# EAGLE design Mosfets (EAGLE 9.3.2)
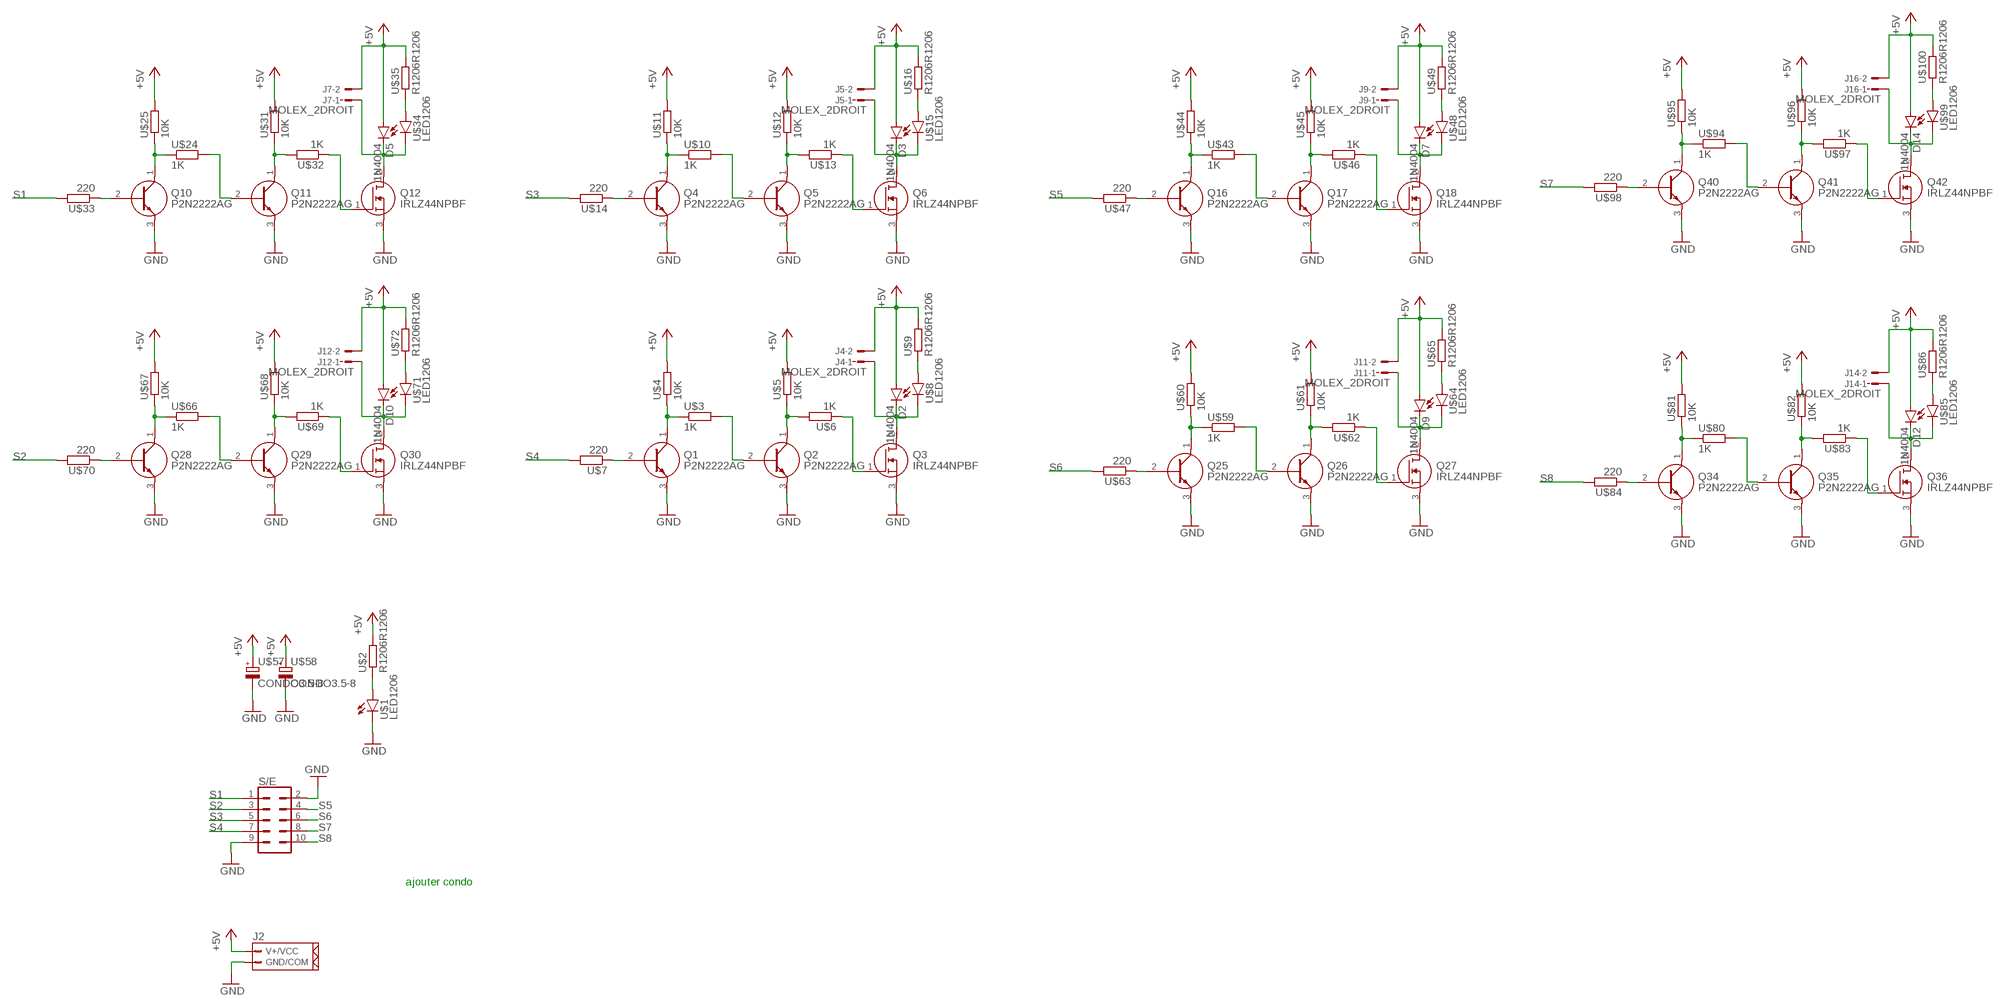
[diagram p0: schematic, sheet 1]

## Parts
D2  1N4004  [DO41-10]
D3  1N4004  [DO41-10]
D5  1N4004  [DO41-10]
D7  1N4004  [DO41-10]
D9  1N4004  [DO41-10]
D10  1N4004  [DO41-10]
D12  1N4004  [DO41-10]
D14  1N4004  [DO41-10]
J2  MOLEX_2_PUISS90°  [CON_2_PUISS_90°]
J4  MOLEX_2DROIT  [CON_2_DROIT]
J5  MOLEX_2DROIT  [CON_2_DROIT]
J7  MOLEX_2DROIT  [CON_2_DROIT]
J9  MOLEX_2DROIT  [CON_2_DROIT]
J11  MOLEX_2DROIT  [CON_2_DROIT]
J12  MOLEX_2DROIT  [CON_2_DROIT]
J14  MOLEX_2DROIT  [CON_2_DROIT]
J16  MOLEX_2DROIT  [CON_2_DROIT]
Q1  P2N2222AG  [TO-92]
Q2  P2N2222AG  [TO-92]
Q3  IRLZ44NPBF  [TO254P469X1042X1967-3P]
Q4  P2N2222AG  [TO-92]
Q5  P2N2222AG  [TO-92]
Q6  IRLZ44NPBF  [TO254P469X1042X1967-3P]
Q10  P2N2222AG  [TO-92]
Q11  P2N2222AG  [TO-92]
Q12  IRLZ44NPBF  [TO254P469X1042X1967-3P]
Q16  P2N2222AG  [TO-92]
Q17  P2N2222AG  [TO-92]
Q18  IRLZ44NPBF  [TO254P469X1042X1967-3P]
Q25  P2N2222AG  [TO-92]
Q26  P2N2222AG  [TO-92]
Q27  IRLZ44NPBF  [TO254P469X1042X1967-3P]
Q28  P2N2222AG  [TO-92]
Q29  P2N2222AG  [TO-92]
Q30  IRLZ44NPBF  [TO254P469X1042X1967-3P]
Q34  P2N2222AG  [TO-92]
Q35  P2N2222AG  [TO-92]
Q36  IRLZ44NPBF  [TO254P469X1042X1967-3P]
Q40  P2N2222AG  [TO-92]
Q41  P2N2222AG  [TO-92]
Q42  IRLZ44NPBF  [TO254P469X1042X1967-3P]
S/E  CON_5X2SHD  [2X5-SHROUDED]
U$1  LED1206  [1206]
U$2  R1206R1206  [R1206]
U$3  1K  R1206R1206  [R1206]
U$4  10K  R1206R1206  [R1206]
U$5  10K  R1206R1206  [R1206]
U$6  1K  R1206R1206  [R1206]
U$7  220  R1206R1206  [R1206]
U$8  LED1206  [1206]
U$9  R1206R1206  [R1206]
U$10  1K  R1206R1206  [R1206]
U$11  10K  R1206R1206  [R1206]
U$12  10K  R1206R1206  [R1206]
U$13  1K  R1206R1206  [R1206]
U$14  220  R1206R1206  [R1206]
U$15  LED1206  [1206]
U$16  R1206R1206  [R1206]
U$24  1K  R1206R1206  [R1206]
U$25  10K  R1206R1206  [R1206]
U$31  10K  R1206R1206  [R1206]
U$32  1K  R1206R1206  [R1206]
U$33  220  R1206R1206  [R1206]
U$34  LED1206  [1206]
U$35  R1206R1206  [R1206]
U$43  1K  R1206R1206  [R1206]
U$44  10K  R1206R1206  [R1206]
U$45  10K  R1206R1206  [R1206]
U$46  1K  R1206R1206  [R1206]
U$47  220  R1206R1206  [R1206]
U$48  LED1206  [1206]
U$49  R1206R1206  [R1206]
U$57  CONDO3.5-8  [E3,5-8]
U$58  CONDO3.5-8  [E3,5-8]
U$59  1K  R1206R1206  [R1206]
U$60  10K  R1206R1206  [R1206]
U$61  10K  R1206R1206  [R1206]
U$62  1K  R1206R1206  [R1206]
U$63  220  R1206R1206  [R1206]
U$64  LED1206  [1206]
U$65  R1206R1206  [R1206]
U$66  1K  R1206R1206  [R1206]
U$67  10K  R1206R1206  [R1206]
U$68  10K  R1206R1206  [R1206]
U$69  1K  R1206R1206  [R1206]
U$70  220  R1206R1206  [R1206]
U$71  LED1206  [1206]
U$72  R1206R1206  [R1206]
U$80  1K  R1206R1206  [R1206]
U$81  10K  R1206R1206  [R1206]
U$82  10K  R1206R1206  [R1206]
U$83  1K  R1206R1206  [R1206]
U$84  220  R1206R1206  [R1206]
U$85  LED1206  [1206]
U$86  R1206R1206  [R1206]
U$94  1K  R1206R1206  [R1206]
U$95  10K  R1206R1206  [R1206]
U$96  10K  R1206R1206  [R1206]
U$97  1K  R1206R1206  [R1206]
U$98  220  R1206R1206  [R1206]
U$99  LED1206  [1206]
U$100  R1206R1206  [R1206]

## Nets
+5V: D2.A D3.A D5.A D7.A D9.A D10.A D12.A D14.A J2.P$2(V+/VCC) J4.2 J5.2 J7.2 J9.2 J11.2 J12.2 J14.2 J16.2 U$2.2 U$4.2 U$5.2 U$9.2 U$11.2 U$12.2 U$16.2 U$25.2 U$31.2 U$35.2 U$44.2 U$45.2 U$49.2 U$57.+ U$58.+ U$60.2 U$61.2 U$65.2 U$67.2 U$68.2 U$72.2 U$81.2 U$82.2 U$86.2 U$95.2 U$96.2 U$100.2
GND: J2.P$1(GND/COM) Q1.3(E) Q2.3(E) Q3.3(S) Q4.3(E) Q5.3(E) Q6.3(S) Q10.3(E) Q11.3(E) Q12.3(S) Q16.3(E) Q17.3(E) Q18.3(S) Q25.3(E) Q26.3(E) Q27.3(S) Q28.3(E) Q29.3(E) Q30.3(S) Q34.3(E) Q35.3(E) Q36.3(S) Q40.3(E) Q41.3(E) Q42.3(S) S/E.2 S/E.9 U$1.C U$57.- U$58.-
N$2: Q1.1(C) U$3.1 U$4.1
N$3: Q2.1(C) U$5.1 U$6.2
N$4: Q1.2(B) U$7.1
N$5: Q2.2(B) U$3.2
N$6: Q3.1(G) U$6.1
N$7: D2.C J4.1 Q3.2(D) U$8.C
N$8: U$8.A U$9.1
N$9: Q4.1(C) U$10.1 U$11.1
N$10: Q5.1(C) U$12.1 U$13.2
N$11: Q4.2(B) U$14.1
N$12: Q5.2(B) U$10.2
N$13: Q6.1(G) U$13.1
N$14: D3.C J5.1 Q6.2(D) U$15.C
N$15: Q28.1(C) U$66.1 U$67.1
N$16: U$15.A U$16.1
N$17: U$1.A U$2.1
N$25: Q10.1(C) U$24.1 U$25.1
N$26: Q11.1(C) U$31.1 U$32.2
N$27: Q10.2(B) U$33.1
N$28: Q11.2(B) U$24.2
N$29: Q12.1(G) U$32.1
N$30: D5.C J7.1 Q12.2(D) U$34.C
N$31: U$34.A U$35.1
N$39: Q16.1(C) U$43.1 U$44.1
N$40: Q17.1(C) U$45.1 U$46.2
N$41: Q16.2(B) U$47.1
N$42: Q17.2(B) U$43.2
N$43: Q18.1(G) U$46.1
N$44: D7.C J9.1 Q18.2(D) U$48.C
N$45: U$48.A U$49.1
N$54: Q29.1(C) U$68.1 U$69.2
N$58: Q25.1(C) U$59.1 U$60.1
N$60: Q26.1(C) U$61.1 U$62.2
N$61: Q25.2(B) U$63.1
N$62: Q26.2(B) U$59.2
N$63: Q27.1(G) U$62.1
N$64: D9.C J11.1 Q27.2(D) U$64.C
N$65: U$64.A U$65.1
N$66: Q28.2(B) U$70.1
N$67: Q29.2(B) U$66.2
N$68: Q30.1(G) U$69.1
N$69: D10.C J12.1 Q30.2(D) U$71.C
N$70: U$71.A U$72.1
N$78: Q34.1(C) U$80.1 U$81.1
N$79: Q35.1(C) U$82.1 U$83.2
N$80: Q34.2(B) U$84.1
N$81: Q35.2(B) U$80.2
N$82: Q36.1(G) U$83.1
N$83: D12.C J14.1 Q36.2(D) U$85.C
N$84: U$85.A U$86.1
N$92: Q40.1(C) U$94.1 U$95.1
N$93: Q41.1(C) U$96.1 U$97.2
N$94: Q40.2(B) U$98.1
N$95: Q41.2(B) U$94.2
N$96: Q42.1(G) U$97.1
N$97: D14.C J16.1 Q42.2(D) U$99.C
N$98: U$99.A U$100.1
S1: S/E.1 U$33.2
S2: S/E.3 U$70.2
S3: S/E.5 U$14.2
S4: S/E.7 U$7.2
S5: S/E.4 U$47.2
S6: S/E.6 U$63.2
S7: S/E.8 U$98.2
S8: S/E.10 U$84.2

## Notes on the sheet
- ajouter condo

## Library data of the parts
D2 D3 D5 D7 D9 D10 D12 D14 = AREA:1N4004: DIODE general purpose rectifier, 1 A
J2 = AREA:MOLEX_2_PUISS: Solid Header 3.96mm KK ,r/a,F/Lock,2w Molex KK Series, Series Number 41792, 3.96mm Pitch 2 Way 1 Row Right Angle PCB Header, Solder Termination, 7A Source: Datasheet <http://www.molex.com/webdocs/datasheets/pdf/en-us/0026605020_PCB_HEADERS.pdf>
J4 J5 J7 J9 J11 J12 J14 J16 = AREA:MOLEX_2: CONNECTOR wire to board 2.54 mm (.1 inch) pitch header; MF: MOLEX; OC_FARNELL: unknown; OC_NEWARK: unknown
Q1 Q2 Q4 Q5 Q10 Q11 Q16 Q17 Q25 Q26 Q28 Q29 Q34 Q35 Q40 Q41 = AREA:P2N2222AG: NPN transistor,P2N2222A 0.6A Ic 10Vce ON Semi P2N2222AG NPN Bipolar Transistor, 0.6 A 40 V, 3-Pin TO-92 Source: Datasheet <http://www.onsemi.com/pub/Collateral/P2N2222A-D.PDF>; ALLIED_NUMBER: R1107250; ALLIED_PRICE-STOCK: http://www.alliedelec.com/on-semiconductor-p2n2222ag/R1107250/; DESCRIPTION: NPN transistor,P2N2222A 0.6A Ic 10Vce ON Semi P2N2222AG NPN Bipolar Transistor, 0.6 A 40 V, 3-Pin TO-92; HEIGHT: mm; MANUFACTURER_NAME: ON Semiconductor; MANUFACTURER_PART_NUMBER: P2N2222AG; MOUSER_PART_NUMBER: 863-P2N2222AG; MOUSER_PRICE-STOCK: https://www.mouser.com/Search/Refine.aspx?Keyword=863-P2N2222AG; RS_PART_NUMBER: 5449624P; RS_PRICE-STOCK: http://uk.rs-online.com/web/p/products/5449624P
Q3 Q6 Q12 Q18 Q27 Q30 Q36 Q42 = AREA:IRLZ44NPBF: N-channel MOSFET,IRLZ44N 47A 55V Source: Datasheet <http://www.irf.com/product-info/datasheets/data/irlz44n.pdf>; DESCRIPTION: N-channel MOSFET,IRLZ44N 47A 55V; HEIGHT: 4.69mm; MANUFACTURER_NAME: International Rectifier; MANUFACTURER_PART_NUMBER: IRLZ44NPBF; RS_PART_NUMBER: 2509061408; RS_PRICE-STOCK: http://uk.rs-online.com/web/p/products/2509061408
S/E = AREA:CON_5X2: Multi connection point. Often used as Generic Header-pin footprint for 0.1 inch spaced/style header connections For AVR SPI programming port, see special device with nice symbol: "AVR_SPI_PROG_5x2.dev" You can populate with any combo of single row headers, but if you'd like an exact match, check these: 2x5 AVR ICSP Male Header <https://www.sparkfun.com/products/778> (PRT-00778) 2x5 Pin Shrouded Header <https://www.sparkfun.com/products/8506> (PRT-08506) On any of the 0.1 inch spaced packages, you can populate with these: Break Away Headers - Straight <https://www.sparkfun.com/products/116> (PRT-00116) Break Away Male Headers - Right Angle <https://www.sparkfun.com/products/553> (PRT-00553) Female Headers <https://www.sparkfun.com/products/115> (PRT-00115) Break Away Headers - Machine Pin <https://www.sparkfun.com/products/117> (PRT-00117) Break Away Female Headers - Swiss Machine Pin <https://www.sparkfun.com/products/743> (PRT-00743) Special note: the shrouded connector mates well with our 5x2 ribbon cables: 2x5 Pin IDC Ribbon Cable <https://www.sparkfun.com/products/8535> (PRT-08535); PROD_ID: CONN-08671; SF_ID: PRT-08506
U$1 U$8 U$15 U$34 U$48 U$64 U$71 U$85 U$99 = AREA:LED1206
U$2-U$7 U$9-U$14 U$16 U$24 U$25 U$31-U$33 U$35 U$43-U$47 U$49 U$59-U$63 U$65-U$70 U$72 U$80-U$84 U$86 U$94-U$98 U$100 = AREA:R1206
U$57 U$58 = AREA:CONDO

## Board
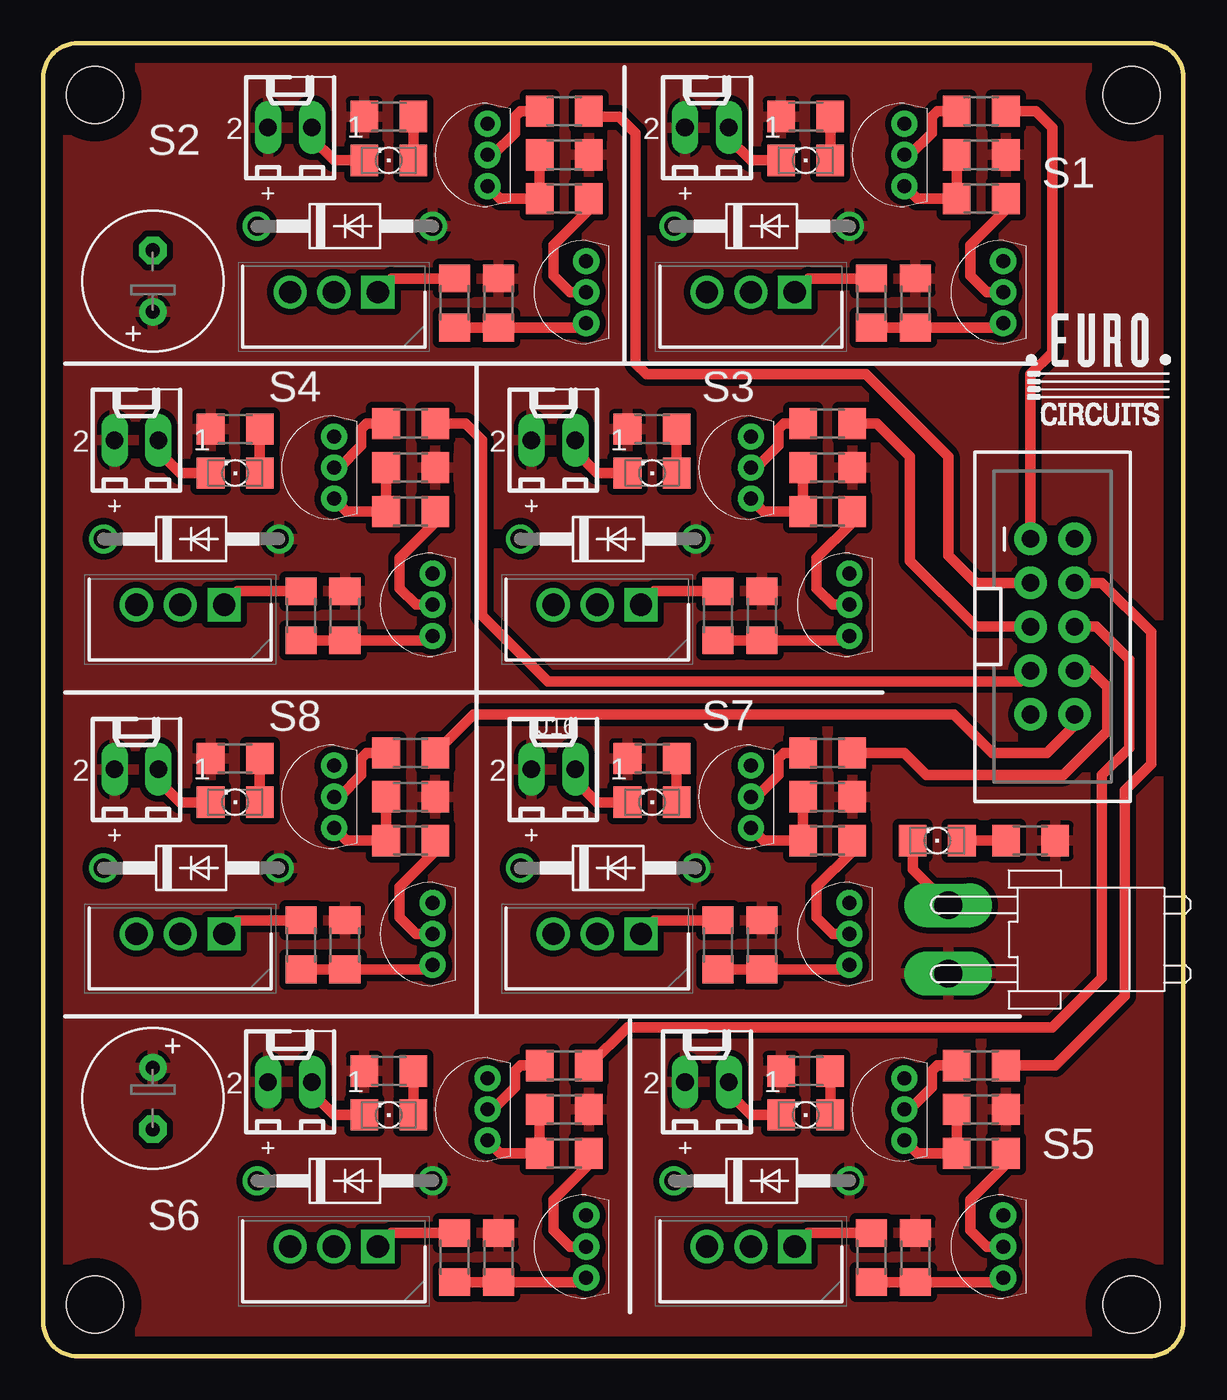
[diagram p1: board, top side]
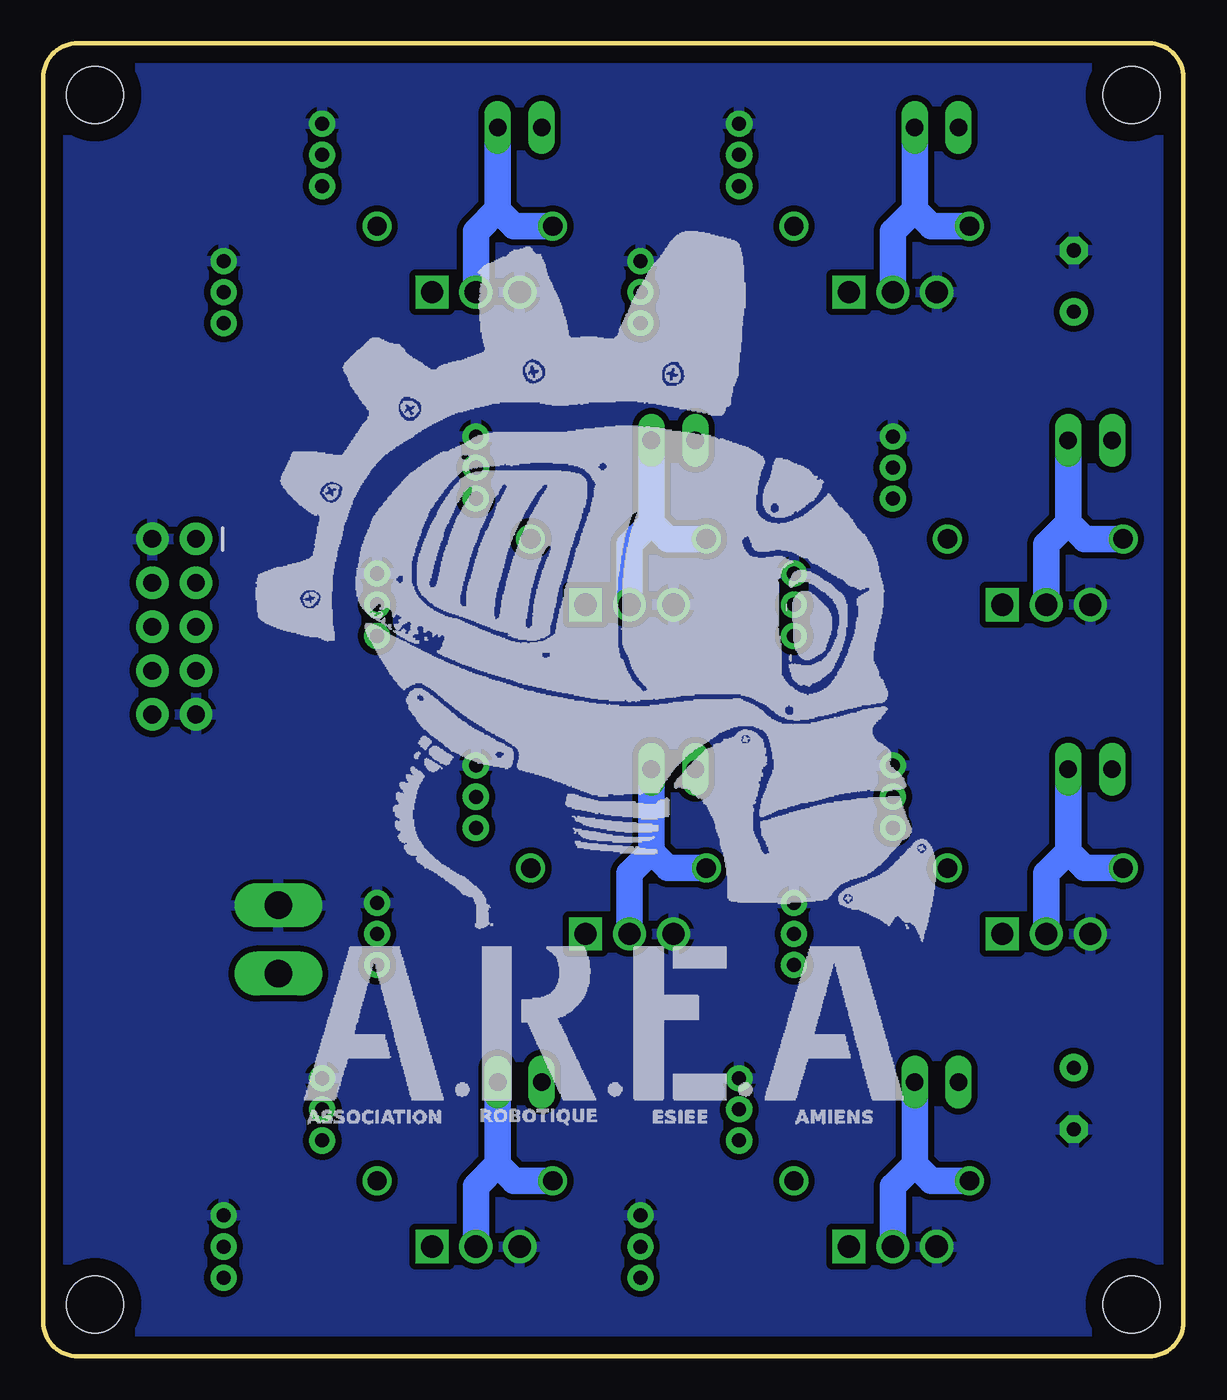
[diagram p2: board, bottom side, seen from below]

Size 66 x 76 mm. Coordinates in mm from the lower left corner, seen from the top.
Outline: 2,76 arc90 0,74 0,2 arc90 2,0 64,0 arc90 66,2 66,74 arc90 64,76 2,76
Copper layers (1*16): Top 0.035mm / dielectric 1.5mm / Bottom 0.035mm
Design rules "default *": minimum track width 12mil, minimum drill 0.35mm, track to track 14mil, track to pad 12mil, pad to pad 10mil, via to via 12mil, smd to smd 12mil, copper to edge 40mil, drill to drill 6mil, minimum pad ring 10mil, minimum via ring 8mil, stop-mask expansion 4mil, vias tented up to drill 0mil, thermal gap 10mil
Holes 3.3 mm at 63,3 3,3 3,73 63,73

### Footprints (pad centres in the part's own frame; a part is rotated, then mirrored left to right if it is on the bottom)
DO41-10 = drill 1.118: A 5.08,0; C -5.08,0
CON_2_PUISS_90° = drill 1.6 pad 2.54 long: P$1 -1.98,0; P$2 1.98,0
CON_2_DROIT = drill 1.016 long: 1 1.27,0; 2 -1.27,0
TO-92 = drill 0.81 pad 1.51: 1 0,-1.8; 2 0,0; 3 0,1.8
TO254P469X1042X1967-3P = drill 1.28 pad 1.92 square: 1 0,0 | drill 1.28 pad 1.92: 2 2.54,0; 3 5.08,0
2X5-SHROUDED = drill 1.016 pad 1.88: 1 -1.27,5.08; 2 1.27,5.08; 3 -1.27,2.54; 4 1.27,2.54; 5 -1.27,0; 6 1.27,0; 7 -1.27,-2.54; 8 1.27,-2.54; 9 -1.27,-5.08; 10 1.27,-5.08
1206 = smd 1.6 x 1.803: A -1.422,0; C 1.422,0
R1206 = smd 1.6 x 1.803: 1 -1.422,0; 2 1.422,0
E3,5-8 = drill 0.813 pad 1.6: + -1.778,0 | drill 0.813 pad 1.6 octagon: - 1.778,0

### Placement (x,y rotation side)
D2  8.57,47.31 0 top
D3  32.7,47.31 0 top
D5  41.59,65.41 0 top
D7  41.59,10.16 0 top
D9  17.46,10.16 0 top
D10  17.46,65.41 0 top
D12  8.57,28.26 0 top
D14  32.7,28.26 0 top
J2  52.39,24.13 270 top
J4  5.4,53.02 0 top
J5  29.53,53.02 0 top
J7  38.42,71.12 0 top
J9  38.42,15.88 0 top
J11  14.29,15.88 0 top
J12  14.29,71.12 0 top
J14  5.4,33.97 0 top
J16  29.53,33.97 0 top
Q1  16.83,51.44 0 top
Q2  22.54,43.5 0 top
Q3  10.48,43.5 180 top
Q4  40.96,51.44 0 top
Q5  46.67,43.5 0 top
Q6  34.61,43.5 180 top
Q10  49.85,69.53 0 top
Q11  55.56,61.59 0 top
Q12  43.5,61.59 180 top
Q16  49.85,14.29 0 top
Q17  55.56,6.35 0 top
Q18  43.5,6.35 180 top
Q25  25.72,14.29 0 top
Q26  31.43,6.35 0 top
Q27  19.37,6.35 180 top
Q28  25.72,69.53 0 top
Q29  31.43,61.59 0 top
Q30  19.37,61.59 180 top
Q34  16.83,32.38 0 top
Q35  22.54,24.45 0 top
Q36  10.48,24.45 180 top
Q40  40.96,32.38 0 top
Q41  46.67,24.45 0 top
Q42  34.61,24.45 180 top
S/E  58.42,42.23 0 top
U$1  51.75,29.84 180 top
U$2  57.15,29.84 0 top
U$3  21.27,48.9 0 top
U$4  21.27,51.44 0 top
U$5  17.46,42.86 90 top
U$6  14.92,42.86 270 top
U$7  21.27,53.98 0 top
U$8  11.11,51.12 180 top
U$9  11.11,53.66 180 top
U$10  45.4,48.9 0 top
U$11  45.4,51.44 0 top
U$12  41.59,42.86 90 top
U$13  39.05,42.86 270 top
U$14  45.4,53.98 0 top
U$15  35.24,51.12 180 top
U$16  35.24,53.66 180 top
U$24  54.29,66.99 0 top
U$25  54.29,69.53 0 top
U$31  50.48,60.96 90 top
U$32  47.94,60.96 270 top
U$33  54.29,72.07 0 top
U$34  44.13,69.22 180 top
U$35  44.13,71.75 180 top
U$43  54.29,11.75 0 top
U$44  54.29,14.29 0 top
U$45  50.48,5.71 90 top
U$46  47.94,5.71 270 top
U$47  54.29,16.83 0 top
U$48  44.13,13.97 180 top
U$49  44.13,16.51 180 top
U$57  6.35,62.23 90 top
U$58  6.35,14.92 270 top
U$59  30.16,11.75 0 top
U$60  30.16,14.29 0 top
U$61  26.35,5.71 90 top
U$62  23.81,5.71 270 top
U$63  30.16,16.83 0 top
U$64  20,13.97 180 top
U$65  20,16.51 180 top
U$66  30.16,66.99 0 top
U$67  30.16,69.53 0 top
U$68  26.35,60.96 90 top
U$69  23.81,60.96 270 top
U$70  30.16,72.07 0 top
U$71  20,69.22 180 top
U$72  20,71.75 180 top
U$80  21.27,29.84 0 top
U$81  21.27,32.38 0 top
U$82  17.46,23.81 90 top
U$83  14.92,23.81 270 top
U$84  21.27,34.92 0 top
U$85  11.11,32.07 180 top
U$86  11.11,34.61 180 top
U$94  45.4,29.84 0 top
U$95  45.4,32.38 0 top
U$96  41.59,23.81 90 top
U$97  39.05,23.81 270 top
U$98  45.4,34.92 0 top
U$99  35.24,32.07 180 top
U$100  35.24,34.61 180 top

### Tracks (layer width: path | path; a pad name or v marks a point on that pad's centre or on a via)
+5V
  pour Top: -3.81,77.15 -3.81,-6.03 71.12,-6.03 71.12,77.15
GND
  Top 0.61: U$1.C 50.33,28.17 J2.P$1
  pour Bottom: -5.71,79.06 -5.71,-7.62 73.34,-7.62 73.34,79.06
N$2
  Top 0.61: U$4.1 U$3.1 17.57,48.9 Q1.1
N$3
  Top 0.61: U$6.2 U$5.1 22.29,41.44 Q2.1
N$4
  Top 0.61: U$7.1 18.73,53.98 18.41,53.66 18.41,52.7 17.14,51.44 Q1.2
N$5
  Top 0.61: U$3.2 22.7,48.26 20.64,46.2 20.64,44.45 21.59,43.5 Q2.2
N$6
  Top 0.61: U$6.1 11.26,44.28 Q3.1
N$7
  Top 0.61: U$8.C 7.94,51.12 6.67,52.39 J4.1
  Bottom 1.524: J4.1 6.67,48.26 | 6.67,48.26 7.94,46.99 Q3.2 | D2.C 5.71,47.31 6.67,48.26
N$8
  Top 0.61: U$9.1 U$8.A
N$9
  Top 0.61: U$11.1 U$10.1 41.7,48.9 Q4.1
N$10
  Top 0.61: U$13.2 U$12.1 46.42,41.44 Q5.1
N$11
  Top 0.61: U$14.1 42.86,53.98 42.55,53.66 42.55,52.7 41.27,51.44 Q4.2
N$12
  Top 0.61: U$10.2 46.83,48.26 44.77,46.2 44.77,44.45 45.72,43.5 Q5.2
N$13
  Top 0.61: U$13.1 35.4,44.28 Q6.1
N$14
  Top 0.61: U$15.C 32.07,51.12 30.8,52.39 J5.1
  Bottom 1.524: J5.1 30.8,48.26 | 30.8,48.26 32.07,46.99 Q6.2 | D3.C 29.84,47.31 30.8,48.26
N$15
  Top 0.61: U$67.1 U$66.1 26.46,66.99 Q28.1
N$16
  Top 0.61: U$16.1 U$15.A
N$17
  Top 0.61: U$2.1 U$1.A
N$25
  Top 0.61: U$25.1 U$24.1 50.59,66.99 Q10.1
N$26
  Top 0.61: U$32.2 U$31.1 55.31,59.54 Q11.1
N$27
  Top 0.61: U$33.1 51.75,72.07 51.44,71.75 51.44,70.8 50.16,69.53 Q10.2
N$28
  Top 0.61: U$24.2 55.72,66.36 53.66,64.3 53.66,62.55 54.61,61.59 Q11.2
N$29
  Top 0.61: U$32.1 44.28,62.38 Q12.1
N$30
  Top 0.61: U$34.C 40.96,69.22 39.69,70.48 J7.1
  Bottom 1.524: J7.1 39.69,66.36 | 39.69,66.36 40.96,65.09 Q12.2 | D5.C 38.73,65.41 39.69,66.36
N$31
  Top 0.61: U$35.1 U$34.A
N$39
  Top 0.61: U$44.1 U$43.1 50.59,11.75 Q16.1
N$40
  Top 0.61: U$46.2 U$45.1 55.31,4.29 Q17.1
N$41
  Top 0.61: U$47.1 51.75,16.83 51.44,16.51 51.44,15.56 50.16,14.29 Q16.2
N$42
  Top 0.61: U$43.2 55.72,11.11 53.66,9.06 53.66,7.3 54.61,6.35 Q17.2
N$43
  Top 0.61: U$46.1 44.28,7.14 Q18.1
N$44
  Top 0.61: U$48.C 40.96,13.97 39.69,15.24 J9.1
  Bottom 1.524: J9.1 39.69,11.11 | 39.69,11.11 40.96,9.84 Q18.2 | D7.C 38.73,10.16 39.69,11.11
N$45
  Top 0.61: U$49.1 U$48.A
N$54
  Top 0.61: U$69.2 U$68.1 31.18,59.54 Q29.1
N$58
  Top 0.61: U$60.1 U$59.1 26.46,11.75 Q25.1
N$60
  Top 0.61: U$62.2 U$61.1 31.18,4.29 Q26.1
N$61
  Top 0.61: U$63.1 27.62,16.83 27.3,16.51 27.3,15.56 26.04,14.29 Q25.2
N$62
  Top 0.61: U$59.2 31.58,11.11 29.53,9.06 29.53,7.3 30.48,6.35 Q26.2
N$63
  Top 0.61: U$62.1 20.15,7.14 Q27.1
N$64
  Top 0.61: U$64.C 16.83,13.97 15.56,15.24 J11.1
  Bottom 1.524: J11.1 15.56,11.11 | 15.56,11.11 16.83,9.84 Q27.2 | D9.C 14.61,10.16 15.56,11.11
N$65
  Top 0.61: U$65.1 U$64.A
N$66
  Top 0.61: U$70.1 27.62,72.07 27.3,71.75 27.3,70.8 26.04,69.53 Q28.2
N$67
  Top 0.61: U$66.2 31.58,66.36 29.53,64.3 29.53,62.55 30.48,61.59 Q29.2
N$68
  Top 0.61: U$69.1 20.15,62.38 Q30.1
N$69
  Top 0.61: U$71.C 16.83,69.22 15.56,70.48 J12.1
  Bottom 1.524: J12.1 15.56,66.36 | 15.56,66.36 16.83,65.09 Q30.2 | D10.C 14.61,65.41 15.56,66.36
N$70
  Top 0.61: U$72.1 U$71.A
N$78
  Top 0.61: U$81.1 U$80.1 17.57,29.84 Q34.1
N$79
  Top 0.61: U$83.2 U$82.1 22.29,22.39 Q35.1
N$80
  Top 0.61: U$84.1 18.73,34.92 18.41,34.61 18.41,33.66 17.14,32.38 Q34.2
N$81
  Top 0.61: U$80.2 22.7,29.21 20.64,27.15 20.64,25.4 21.59,24.45 Q35.2
N$82
  Top 0.61: U$83.1 11.26,25.23 Q36.1
N$83
  Top 0.61: U$85.C 7.94,32.07 6.67,33.34 J14.1
  Bottom 1.524: J14.1 6.67,29.21 | 6.67,29.21 7.94,27.94 Q36.2 | D12.C 5.71,28.26 6.67,29.21
N$84
  Top 0.61: U$86.1 U$85.A
N$92
  Top 0.61: U$95.1 U$94.1 41.7,29.84 Q40.1
N$93
  Top 0.61: U$97.2 U$96.1 46.42,22.39 Q41.1
N$94
  Top 0.61: U$98.1 42.86,34.92 42.55,34.61 42.55,33.66 41.27,32.38 Q40.2
N$95
  Top 0.61: U$94.2 46.83,29.21 44.77,27.15 44.77,25.4 45.72,24.45 Q41.2
N$96
  Top 0.61: U$97.1 35.4,25.23 Q42.1
N$97
  Top 0.61: U$99.C 32.07,32.07 30.8,33.34 J16.1
  Bottom 1.524: J16.1 30.8,29.21 | 30.8,29.21 32.07,27.94 Q42.2 | D14.C 29.84,28.26 30.8,29.21
N$98
  Top 0.61: U$100.1 U$99.A
S1
  Top 0.61: U$33.2 57.47,72.07 58.42,71.12 58.42,58.1 57.15,56.83 S/E.1
S2
  Top 0.61: U$70.2 31.9,71.75 33.34,71.75 34.29,70.8 34.29,57.47 34.92,56.83 47.62,56.83 52.39,52.07 52.39,46.35 53.98,44.77 S/E.3
S3
  Top 0.61: U$14.2 48.26,53.98 50.16,52.07 50.16,46.04 53.98,42.23 S/E.5
S4
  Top 0.61: S/E.7 56.52,39.05 29.21,39.05 25.4,42.86 25.4,53.02 24.45,53.98 U$7.2
S5
  Top 0.61: S/E.4 61.28,44.77 64.14,41.91 64.14,34.29 62.6,32.75 62.6,20.85 58.57,16.83 U$47.2
S6
  Top 0.61: U$63.2 33.81,19.05 58.42,19.05 61.28,21.91 61.28,33.63 62.87,35.22 62.87,40.32 60.96,42.23 S/E.6
S7
  Top 0.61: U$98.2 49.85,34.92 51.12,33.66 59.05,33.66 61.59,36.2 61.59,38.73 60.64,39.69 S/E.8
S8
  Top 0.61: S/E.10 59.69,36.51 58.1,34.92 54.93,34.92 52.7,37.15 24.92,37.15 U$84.2

### Text on the board
tNames: S2 | S1 | S4 | S3 | S8 | S7 | S5 | S6